# Altium schematic sheet LED Matrix-2.SchDoc
size Letter
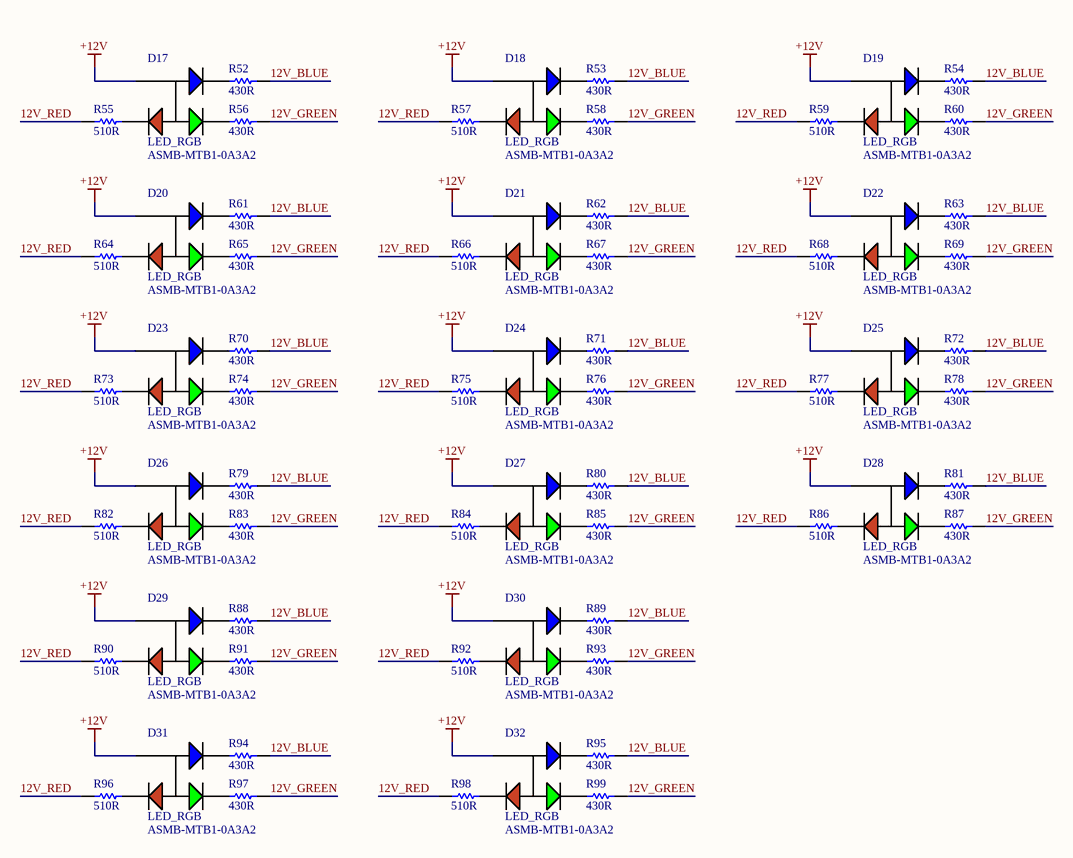
[diagram p0: LED Matrix-2.SchDoc]

## Parts
D17  LED_RGB  Manufacturer Part Number 1: ASMB-MTB1-0A3A2  [LED_RGB]
D18  LED_RGB  Manufacturer Part Number 1: ASMB-MTB1-0A3A2  [LED_RGB]
D19  LED_RGB  Manufacturer Part Number 1: ASMB-MTB1-0A3A2  [LED_RGB]
D20  LED_RGB  Manufacturer Part Number 1: ASMB-MTB1-0A3A2  [LED_RGB]
D21  LED_RGB  Manufacturer Part Number 1: ASMB-MTB1-0A3A2  [LED_RGB]
D22  LED_RGB  Manufacturer Part Number 1: ASMB-MTB1-0A3A2  [LED_RGB]
D23  LED_RGB  Manufacturer Part Number 1: ASMB-MTB1-0A3A2  [LED_RGB]
D24  LED_RGB  Manufacturer Part Number 1: ASMB-MTB1-0A3A2  [LED_RGB]
D25  LED_RGB  Manufacturer Part Number 1: ASMB-MTB1-0A3A2  [LED_RGB]
D26  LED_RGB  Manufacturer Part Number 1: ASMB-MTB1-0A3A2  [LED_RGB]
D27  LED_RGB  Manufacturer Part Number 1: ASMB-MTB1-0A3A2  [LED_RGB]
D28  LED_RGB  Manufacturer Part Number 1: ASMB-MTB1-0A3A2  [LED_RGB]
D29  LED_RGB  Manufacturer Part Number 1: ASMB-MTB1-0A3A2  [LED_RGB]
D30  LED_RGB  Manufacturer Part Number 1: ASMB-MTB1-0A3A2  [LED_RGB]
D31  LED_RGB  Manufacturer Part Number 1: ASMB-MTB1-0A3A2  [LED_RGB]
D32  LED_RGB  Manufacturer Part Number 1: ASMB-MTB1-0A3A2  [LED_RGB]
R52  value 430R  [RESC2012X60N]  (hidden comment: RES_430R_0805)
R53  value 430R  [RESC2012X60N]  (hidden comment: RES_430R_0805)
R54  value 430R  [RESC2012X60N]  (hidden comment: RES_430R_0805)
R55  value 510R  [RESC2012X60N]  (hidden comment: RES_510R_0805)
R56  value 430R  [RESC2012X60N]  (hidden comment: RES_430R_0805)
R57  value 510R  [RESC2012X60N]  (hidden comment: RES_510R_0805)
R58  value 430R  [RESC2012X60N]  (hidden comment: RES_430R_0805)
R59  value 510R  [RESC2012X60N]  (hidden comment: RES_510R_0805)
R60  value 430R  [RESC2012X60N]  (hidden comment: RES_430R_0805)
R61  value 430R  [RESC2012X60N]  (hidden comment: RES_430R_0805)
R62  value 430R  [RESC2012X60N]  (hidden comment: RES_430R_0805)
R63  value 430R  [RESC2012X60N]  (hidden comment: RES_430R_0805)
R64  value 510R  [RESC2012X60N]  (hidden comment: RES_510R_0805)
R65  value 430R  [RESC2012X60N]  (hidden comment: RES_430R_0805)
R66  value 510R  [RESC2012X60N]  (hidden comment: RES_510R_0805)
R67  value 430R  [RESC2012X60N]  (hidden comment: RES_430R_0805)
R68  value 510R  [RESC2012X60N]  (hidden comment: RES_510R_0805)
R69  value 430R  [RESC2012X60N]  (hidden comment: RES_430R_0805)
R70  value 430R  [RESC2012X60N]  (hidden comment: RES_430R_0805)
R71  value 430R  [RESC2012X60N]  (hidden comment: RES_430R_0805)
R72  value 430R  [RESC2012X60N]  (hidden comment: RES_430R_0805)
R73  value 510R  [RESC2012X60N]  (hidden comment: RES_510R_0805)
R74  value 430R  [RESC2012X60N]  (hidden comment: RES_430R_0805)
R75  value 510R  [RESC2012X60N]  (hidden comment: RES_510R_0805)
R76  value 430R  [RESC2012X60N]  (hidden comment: RES_430R_0805)
R77  value 510R  [RESC2012X60N]  (hidden comment: RES_510R_0805)
R78  value 430R  [RESC2012X60N]  (hidden comment: RES_430R_0805)
R79  value 430R  [RESC2012X60N]  (hidden comment: RES_430R_0805)
R80  value 430R  [RESC2012X60N]  (hidden comment: RES_430R_0805)
R81  value 430R  [RESC2012X60N]  (hidden comment: RES_430R_0805)
R82  value 510R  [RESC2012X60N]  (hidden comment: RES_510R_0805)
R83  value 430R  [RESC2012X60N]  (hidden comment: RES_430R_0805)
R84  value 510R  [RESC2012X60N]  (hidden comment: RES_510R_0805)
R85  value 430R  [RESC2012X60N]  (hidden comment: RES_430R_0805)
R86  value 510R  [RESC2012X60N]  (hidden comment: RES_510R_0805)
R87  value 430R  [RESC2012X60N]  (hidden comment: RES_430R_0805)
R88  value 430R  [RESC2012X60N]  (hidden comment: RES_430R_0805)
R89  value 430R  [RESC2012X60N]  (hidden comment: RES_430R_0805)
R90  value 510R  [RESC2012X60N]  (hidden comment: RES_510R_0805)
R91  value 430R  [RESC2012X60N]  (hidden comment: RES_430R_0805)
R92  value 510R  [RESC2012X60N]  (hidden comment: RES_510R_0805)
R93  value 430R  [RESC2012X60N]  (hidden comment: RES_430R_0805)
R94  value 430R  [RESC2012X60N]  (hidden comment: RES_430R_0805)
R95  value 430R  [RESC2012X60N]  (hidden comment: RES_430R_0805)
R96  value 510R  [RESC2012X60N]  (hidden comment: RES_510R_0805)
R97  value 430R  [RESC2012X60N]  (hidden comment: RES_430R_0805)
R98  value 510R  [RESC2012X60N]  (hidden comment: RES_510R_0805)
R99  value 430R  [RESC2012X60N]  (hidden comment: RES_430R_0805)

## Nets
+12V: D17.4 D18.4 D19.4 D20.4 D21.4 D22.4 D23.4 D24.4 D25.4 D26.4 D27.4 D28.4 D29.4 D30.4 D31.4 D32.4
12V_BLUE: R52.1 R53.1 R54.1 R61.1 R62.1 R63.1 R70.1 R71.1 R72.1 R79.1 R80.1 R81.1 R88.1 R89.1 R94.1 R95.1
12V_GREEN: R56.1 R58.1 R60.1 R65.1 R67.1 R69.1 R74.1 R76.1 R78.1 R83.1 R85.1 R87.1 R91.1 R93.1 R97.1 R99.1
12V_RED: R55.2 R57.2 R59.2 R64.2 R66.2 R68.2 R73.2 R75.2 R77.2 R82.2 R84.2 R86.2 R90.2 R92.2 R96.2 R98.2
NetD17_1: D17.1 R55.1
NetD17_2: D17.2 R56.2
NetD17_3: D17.3 R52.2
NetD18_1: D18.1 R57.1
NetD18_2: D18.2 R58.2
NetD18_3: D18.3 R53.2
NetD19_1: D19.1 R59.1
NetD19_2: D19.2 R60.2
NetD19_3: D19.3 R54.2
NetD20_1: D20.1 R64.1
NetD20_2: D20.2 R65.2
NetD20_3: D20.3 R61.2
NetD21_1: D21.1 R66.1
NetD21_2: D21.2 R67.2
NetD21_3: D21.3 R62.2
NetD22_1: D22.1 R68.1
NetD22_2: D22.2 R69.2
NetD22_3: D22.3 R63.2
NetD23_1: D23.1 R73.1
NetD23_2: D23.2 R74.2
NetD23_3: D23.3 R70.2
NetD24_1: D24.1 R75.1
NetD24_2: D24.2 R76.2
NetD24_3: D24.3 R71.2
NetD25_1: D25.1 R77.1
NetD25_2: D25.2 R78.2
NetD25_3: D25.3 R72.2
NetD26_1: D26.1 R82.1
NetD26_2: D26.2 R83.2
NetD26_3: D26.3 R79.2
NetD27_1: D27.1 R84.1
NetD27_2: D27.2 R85.2
NetD27_3: D27.3 R80.2
NetD28_1: D28.1 R86.1
NetD28_2: D28.2 R87.2
NetD28_3: D28.3 R81.2
NetD29_1: D29.1 R90.1
NetD29_2: D29.2 R91.2
NetD29_3: D29.3 R88.2
NetD30_1: D30.1 R92.1
NetD30_2: D30.2 R93.2
NetD30_3: D30.3 R89.2
NetD31_1: D31.1 R96.1
NetD31_2: D31.2 R97.2
NetD31_3: D31.3 R94.2
NetD32_1: D32.1 R98.1
NetD32_2: D32.2 R99.2
NetD32_3: D32.3 R95.2

## Notes on the sheet
- Title
- Size:
- Date:
- Letter
- Drawn By:
- Sheet
- of
- File:

## Library data of the parts
D17-D32 = LED_RGB: LED RGB DIFFUSED 4PLCC SMD; Manufacturer 1: Broadcom; Color: Blue,Green,Red; Lens Color: White; Viewing Angle: 115°; Lens Style: Round; Luminous Intensity: 350mcd; Dominant Wavelength: 470nm; Forward Voltage: 3.1V; Test Current: 20mA; Supplier 1: Digi-Key; Stock 1: 142531; Pricing 1: 1=0.60000, 10=0.47100, 100=0.30210, 500=0.25980, 1000=0.20059 (USD); RoHS: Yes; Mount: Surface Mount; Case/Package: PLCC; Number of Pins: 4; Packaging: Cut Tape; Lens Transparency: Diffused; Length: 3.2mm; Height: 1.9mm; Width: 2.8mm; REACH SVHC: No SVHC; ComponentLink1URL: http://www.farnell.com/datasheets/2111106.pdf?src-supplier=Farnell; ComponentLink1Description: http://www.farnell.com/datasheets/2111106.pdf?src-supplier=Farnell; ComponentLink2URL: https://docs.broadcom.com/docs/AV02-4194EN?src-supplier=Digi-Key; ComponentLink2Description: https://docs.broadcom.com/docs/AV02-4194EN?src-supplier=Digi-Key; ComponentLink3URL: http://www.farnell.com/datasheets/1801564.pdf?src-supplier=Element14; ComponentLink3Description: http://www.farnell.com/datasheets/1801564.pdf?src-supplier=Element14; ComponentLink4URL: http://www.farnell.com/datasheets/2111106.pdf?src-supplier=Newark; ComponentLink4Description: http://www.farnell.com/datasheets/2111106.pdf?src-supplier=Newark; Supplier Part Number 1: 516-3280-1-ND
R52-R54 R56 R58 R60-R63 R65 R67 R69-R72 R74 R76 R78-R81 R83 R85 R87-R89 R91 R93-R95 R97 R99 = RES_430R_0805: RES SMD 430 OHM 1% 1/8W 0805; Manufacturer 1: Vishay Dale; Manufacturer Part Number 1: CRCW0805430RFKEA; Temperature Coefficient: 100ppm/°C; Power Rating: 125mW; Voltage Rating: 150V; Supplier 1: Digi-Key; Tolerance: 1%; Supplier Part Number 1: 541-430CCT-ND; Mount: Surface Mount; Stock 1: 2755291; Pricing 1: 1=0.10000, 10=0.03500, 100=0.01400, 1000=0.00631, 2500=0.00548 (USD); RoHS: Yes; Case/Package: Molded; Contact Plating: Tin,Lead,Matte; Case Code (Imperial): 0805; Case Code (Metric): 2012; Min Operating Temperature: -55°C; Max Operating Temperature: 155°C; Resistance: 430R; Packaging: Tape and Reel; Composition: Thick Film; Termination: SMD/SMT; Military Standard: Not; Length: 2mm; Depth: 1.25mm; Radiation Hardening: No; REACH SVHC: Unknown; Lead Free: Lead Free; ComponentLink1Description: Datasheet; ComponentLink1URL: http://www.vishay.com/docs/20035/dcrcwe3.pdf
R55 R57 R59 R64 R66 R68 R73 R75 R77 R82 R84 R86 R90 R92 R96 R98 = RES_510R_0805: RES SMD 510 OHM 1% 1/8W 0805; Manufacturer 1: Vishay Dale; Manufacturer Part Number 1: CRCW0805510RFKEA; Temperature Coefficient: 100ppm/°C; Power Rating: 125mW; Voltage Rating: 150V; Supplier 1: Digi-Key; Stock 1: 2755291; Pricing 1: 1=0.10000, 10=0.03500, 100=0.01400, 1000=0.00631, 2500=0.00548 (USD); RoHS: Yes; Supplier Part Number 1: 541-510CCT-ND; Mount: Surface Mount; Case/Package: Molded; Contact Plating: Tin,Lead,Matte; Case Code (Imperial): 0805; Case Code (Metric): 2012; Min Operating Temperature: -55°C; Max Operating Temperature: 155°C; Resistance: 510R; Tolerance: 1%; Packaging: Tape and Reel; Composition: Thick Film; Termination: SMD/SMT; Military Standard: Not; Length: 2mm; Depth: 1.25mm; Radiation Hardening: No; REACH SVHC: Unknown; Lead Free: Lead Free; ComponentLink1Description: Datasheet; ComponentLink1URL: http://www.vishay.com/docs/20035/dcrcwe3.pdf